# Altium schematic sheet BCDto7.schdoc: BCD to 7-Segment Decoder / Driver
size B; Organization: Altium Limited; Address1: L3, 12a Rodborough Rd; Address2: Frenchs Forest; Address3: NSW; Address4: Australia 2086; DocumentNumber: 1; SheetNumber: 1; SheetTotal: 1
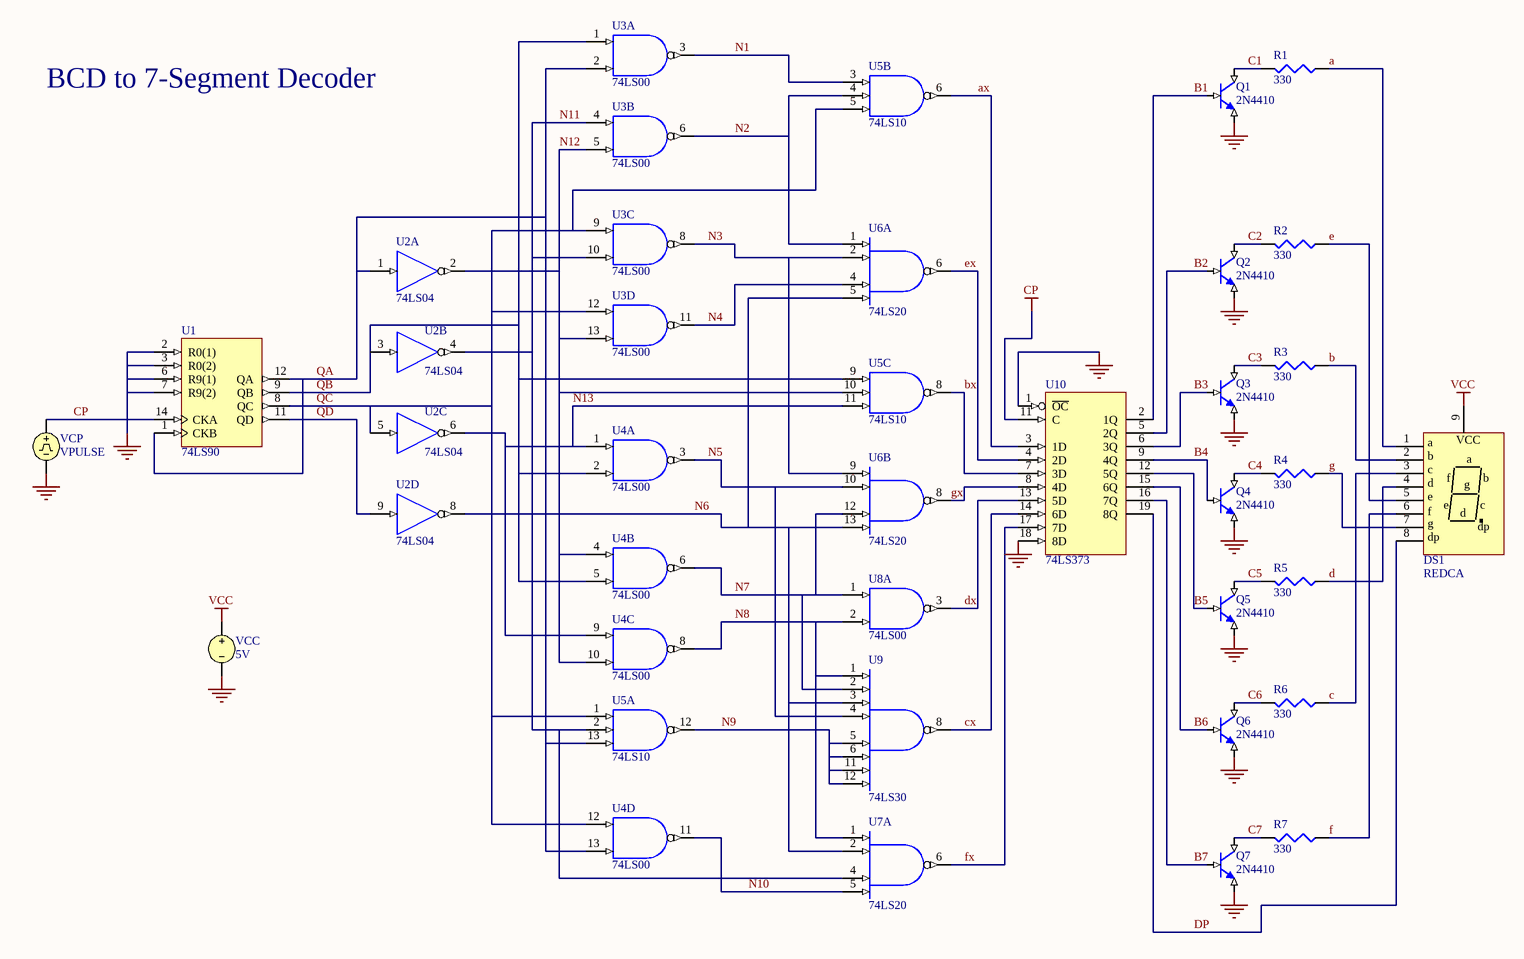
[diagram p0: BCDto7.schdoc]

## Parts
DS1  REDCA
Q1  2N4410
Q2  2N4410
Q3  2N4410
Q4  2N4410
Q5  2N4410
Q6  2N4410
Q7  2N4410
R1  330
R2  330
R3  330
R4  330
R5  330
R6  330
R7  330
U1  74LS90
U2  74LS04  (parts A,B,C,D of 6)
U3  74LS00  (parts A,B,C,D of 4)
U4  74LS00  (parts A,B,C,D of 4)
U5  74LS10  (parts A,B,C of 3)
U6  74LS20  (parts A,B of 2)
U7  74LS20  (part A of 2)
U8  74LS00  (part A of 4)
U9  74LS30
U10  74LS373
VCC  5V
VCP  VPULSE

## Nets
CP: U1.14(CKA) U10.11(C) VCP.1
GND: Q1.3(E) Q2.3(E) Q3.3(E) Q4.3(E) Q5.3(E) Q6.3(E) Q7.3(E) U1.2(R0(1)) U1.3(R0(2)) U1.6(R9(1)) U1.7(R9(2)) U1.10(GND) U2.7(GND) U3.7(GND) U4.7(GND) U5.7(GND) U6.7(GND) U7.7(GND) U8.7(GND) U9.7(GND) U10.1(~{OC}) U10.10(GND) U10.18(8D) VCC.2 VCP.2
VCC: DS1.9(VCC) U1.5(VCC) U2.14(VCC) U3.14(VCC) U4.14(VCC) U5.14(VCC) U6.14(VCC) U7.14(VCC) U8.14(VCC) U9.14(VCC) U10.20(VCC) VCC.1
a: DS1.1(a) R1.2(BOT)
ax: U5.6(Y) U10.3(1D)
b: DS1.2(b) R3.2(BOT)
B1: Q1.2(B) U10.2(1Q)
B2: Q2.2(B) U10.5(2Q)
B3: Q3.2(B) U10.6(3Q)
B4: Q4.2(B) U10.9(4Q)
B5: Q5.2(B) U10.12(5Q)
B6: Q6.2(B) U10.15(6Q)
B7: Q7.2(B) U10.16(7Q)
bx: U5.8(Y) U10.7(3D)
c: DS1.3(c) R6.2(BOT)
C1: Q1.1(C) R1.1(TOP)
C2: Q2.1(C) R2.1(TOP)
C3: Q3.1(C) R3.1(TOP)
C4: Q4.1(C) R4.1(TOP)
C5: Q5.1(C) R5.1(TOP)
C6: Q6.1(C) R6.1(TOP)
C7: Q7.1(C) R7.1(TOP)
cx: U9.8(Y) U10.14(6D)
d: DS1.4(d) R5.2(BOT)
DP: DS1.8(dp) U10.19(8Q)
dx: U8.3(Y) U10.13(5D)
e: DS1.5(e) R2.2(BOT)
ex: U6.6(Y) U10.4(2D)
f: DS1.6(f) R7.2(BOT)
fx: U7.6(Y) U10.17(7D)
g: DS1.7(g) R4.2(BOT)
gx: U6.8(Y) U10.8(4D)
N1: U3.3(Y) U5.3(A)
N2: U3.6(Y) U5.4(B) U6.1(A)
N3: U3.8(Y) U6.2(B) U6.9(A)
N4: U3.11(Y) U6.4(C)
N5: U4.3(Y) U6.10(B) U9.4(D)
N6: U2.8(Y) U6.5(D) U6.13(D) U7.2(B) U9.3(C)
N7: U4.6(Y) U6.12(C) U8.1(A) U9.2(B)
N8: U4.8(Y) U7.1(A) U8.2(B) U9.1(A)
N9: U5.12(Y) U9.5(E) U9.6(F) U9.11(G) U9.12(H)
N10: U4.11(Y) U7.5(D)
N11: U2.4(Y) U3.4(A) U3.10(B) U5.2(B) U7.4(C)
N12: U2.2(Y) U3.5(B) U3.13(B) U4.4(A) U4.10(B) U5.10(B)
N13: U2.6(Y) U4.1(A) U4.9(A) U5.11(C)
QA: U1.1(CKB) U1.12(QA) U2.1(A) U3.2(B) U4.13(B) U5.13(C)
QB: U1.9(QB) U2.3(A) U3.1(A) U4.2(B) U4.5(B) U5.9(A)
QC: U1.8(QC) U2.5(A) U3.9(A) U3.12(A) U4.12(A) U5.1(A) U5.5(C)
QD: U1.11(QD) U2.9(A)

## Notes on the sheet
- BCD to 7-Segment Decoder
- Title
- Size:
- Date:
- B
- Number:
- Time:
- Revision:
- Sheet
- of
- File:

## Library data of the parts
DS1 = REDCA: Common Anode Seven-Segment Display, Right Hand Decimal
Q1-Q7 = 2N4410: NPN BJT
R1-R7 = RES: Resistor; Value: 330
U1 = 74LS90: Binary Counter
U2 = 74LS04: Hex Inverter
U3 U4 U8 = 74LS00: Quad 2-Input Positive-NAND Gate
U5 = 74LS10: Triple 3-Input Positive-NAND Gate
U6 U7 = 74LS20: Dual 4-Input Positive-NAND Gate
U9 = 74LS30: 8-Input Positive-NAND Gate
U10 = 74LS373: Octal D-Type Transparent Latch with 3-State Output
VCC = VSRC: Voltage Source; Value: 5V
VCP = VPULSE: Pulse Voltage Source